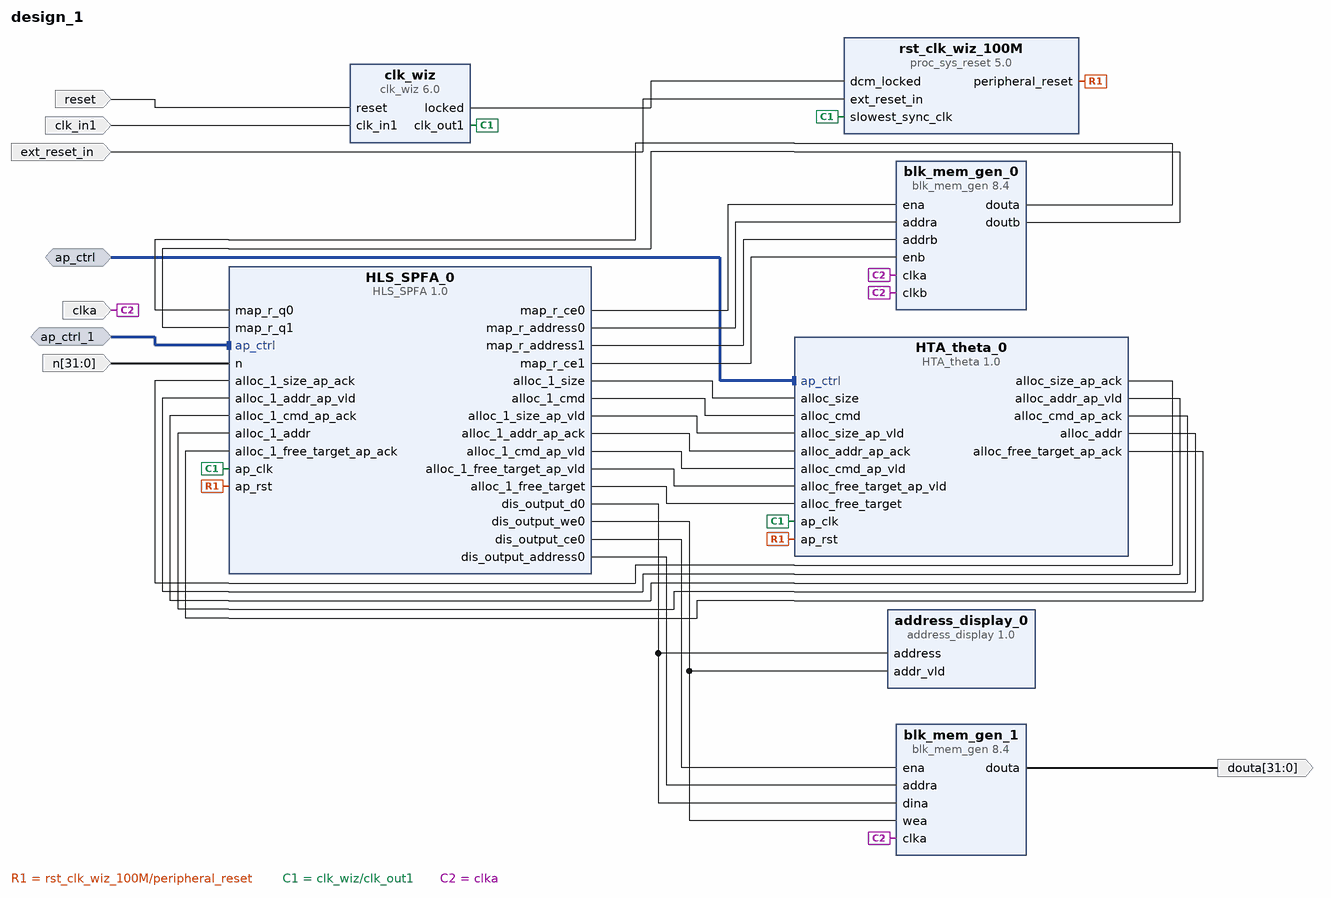
[diagram p0: block diagram of the top level]
# Vivado block design design_1, xc7z020clg484-1, Vivado 2018.2
create_bd_design design_1

create_bd_intf_port -mode Slave -vlnv xilinx.com:interface:acc_handshake_rtl:1.0 ap_ctrl
create_bd_intf_port -mode Slave -vlnv xilinx.com:interface:acc_handshake_rtl:1.0 ap_ctrl_1
create_bd_port -dir I -from 31 -to 0 -type data n
set_property -dict [list \
  CONFIG.LAYERED_METADATA {xilinx.com:interface:datatypes:1.0 {DATA {datatype {name {attribs {resolve_type immediate dependency {} format string minimum {} maximum {}} value {}} bitwidth {attribs {resolve_type immediate dependency {} format long minimum {} maximum {}} value 32} bitoffset {attribs {resolve_type immediate dependency {} format long minimum {} maximum {}} value 0} integer {signed {attribs {resolve_type immediate dependency {} format bool minimum {} maximum {}} value true}}}}}} \
] [get_bd_ports n]
create_bd_port -dir I -type rst reset
set_property -dict {CONFIG.POLARITY ACTIVE_HIGH} [get_bd_ports reset]
create_bd_port -dir I -type clk clk_in1
create_bd_port -dir I -type rst ext_reset_in
create_bd_port -dir O -from 31 -to 0 douta
create_bd_port -dir I -type clk clka

create_bd_cell -type ip -vlnv xilinx.com:hls:HTA_theta:1.0 HTA_theta_0
create_bd_cell -type ip -vlnv xilinx.com:ip:blk_mem_gen:8.4 blk_mem_gen_0
set_property -dict [list \
  CONFIG.Memory_Type Dual_Port_ROM \
  CONFIG.Enable_32bit_Address false \
  CONFIG.Write_Depth_A 20000 \
  CONFIG.Enable_B Use_ENB_Pin \
  CONFIG.Register_PortA_Output_of_Memory_Primitives true \
  CONFIG.Register_PortB_Output_of_Memory_Primitives true \
  CONFIG.Load_Init_File true \
  CONFIG.Coe_File mapINPUT.coe \
  CONFIG.Use_RSTA_Pin false \
  CONFIG.Use_RSTB_Pin false \
  CONFIG.Port_A_Write_Rate 0 \
  CONFIG.Port_B_Clock 100 \
  CONFIG.Port_B_Write_Rate 0 \
  CONFIG.Port_B_Enable_Rate 100 \
  CONFIG.use_bram_block Stand_Alone \
] [get_bd_cells blk_mem_gen_0]
create_bd_cell -type ip -vlnv xilinx.com:ip:blk_mem_gen:8.4 blk_mem_gen_1
set_property -dict [list \
  CONFIG.Memory_Type Single_Port_RAM \
  CONFIG.Enable_32bit_Address false \
  CONFIG.Use_Byte_Write_Enable false \
  CONFIG.Write_Depth_A 200 \
  CONFIG.Register_PortA_Output_of_Memory_Primitives true \
  CONFIG.Use_RSTA_Pin false \
  CONFIG.Port_B_Clock 0 \
  CONFIG.Port_B_Write_Rate 0 \
  CONFIG.Port_B_Enable_Rate 0 \
  CONFIG.use_bram_block Stand_Alone \
] [get_bd_cells blk_mem_gen_1]
create_bd_cell -type ip -vlnv xilinx.com:ip:clk_wiz:6.0 clk_wiz
create_bd_cell -type ip -vlnv xilinx.com:ip:proc_sys_reset:5.0 rst_clk_wiz_100M
create_bd_cell -type ip -vlnv xilinx.com:hls:HLS_SPFA:1.0 HLS_SPFA_0
create_bd_cell -type ip -vlnv user.org:user:address_display:1.0 address_display_0

# ---- connections ----

connect_bd_intf_net [get_bd_intf_ports ap_ctrl] [get_bd_intf_pins HTA_theta_0/ap_ctrl]
connect_bd_intf_net -intf_net ap_ctrl_1_1 [get_bd_intf_ports ap_ctrl_1] [get_bd_intf_pins HLS_SPFA_0/ap_ctrl]
connect_bd_net [get_bd_pins HTA_theta_0/alloc_size_ap_ack] [get_bd_pins HLS_SPFA_0/alloc_1_size_ap_ack]
connect_bd_net [get_bd_pins HTA_theta_0/alloc_addr_ap_vld] [get_bd_pins HLS_SPFA_0/alloc_1_addr_ap_vld]
connect_bd_net [get_bd_pins HTA_theta_0/alloc_cmd_ap_ack] [get_bd_pins HLS_SPFA_0/alloc_1_cmd_ap_ack]
# net HTA_theta_0_alloc_idle_ap_vld has one end: 
connect_bd_net [get_bd_pins HTA_theta_0/alloc_addr] [get_bd_pins HLS_SPFA_0/alloc_1_addr]
connect_bd_net [get_bd_pins HLS_SPFA_0/alloc_1_size] [get_bd_pins HTA_theta_0/alloc_size]
connect_bd_net [get_bd_pins HLS_SPFA_0/alloc_1_cmd] [get_bd_pins HTA_theta_0/alloc_cmd]
connect_bd_net [get_bd_pins HLS_SPFA_0/alloc_1_size_ap_vld] [get_bd_pins HTA_theta_0/alloc_size_ap_vld]
connect_bd_net [get_bd_pins HLS_SPFA_0/alloc_1_addr_ap_ack] [get_bd_pins HTA_theta_0/alloc_addr_ap_ack]
connect_bd_net [get_bd_pins HLS_SPFA_0/alloc_1_cmd_ap_vld] [get_bd_pins HTA_theta_0/alloc_cmd_ap_vld]
# net HLS_SPFA_0_alloc_1_idle_ap_ack has one end: 
# net HTA_theta_0_alloc_idle has one end: 
connect_bd_net [get_bd_pins clk_wiz/locked] [get_bd_pins rst_clk_wiz_100M/dcm_locked]
connect_bd_net [get_bd_pins rst_clk_wiz_100M/peripheral_reset] [get_bd_pins HTA_theta_0/ap_rst] [get_bd_pins HLS_SPFA_0/ap_rst]
connect_bd_net [get_bd_ports n] [get_bd_pins HLS_SPFA_0/n]
connect_bd_net [get_bd_ports reset] [get_bd_pins clk_wiz/reset]
connect_bd_net -net clk_in1_1 [get_bd_ports clk_in1] [get_bd_pins clk_wiz/clk_in1]
connect_bd_net [get_bd_ports ext_reset_in] [get_bd_pins rst_clk_wiz_100M/ext_reset_in]
connect_bd_net [get_bd_pins HLS_SPFA_0/map_r_ce0] [get_bd_pins blk_mem_gen_0/ena]
connect_bd_net [get_bd_pins HLS_SPFA_0/map_r_address0] [get_bd_pins blk_mem_gen_0/addra]
connect_bd_net [get_bd_pins blk_mem_gen_0/douta] [get_bd_pins HLS_SPFA_0/map_r_q0]
connect_bd_net [get_bd_pins HLS_SPFA_0/dis_output_d0] [get_bd_pins blk_mem_gen_1/dina] [get_bd_pins address_display_0/address]
connect_bd_net [get_bd_pins HLS_SPFA_0/dis_output_ce0] [get_bd_pins blk_mem_gen_1/ena]
connect_bd_net [get_bd_pins HLS_SPFA_0/dis_output_we0] [get_bd_pins blk_mem_gen_1/wea] [get_bd_pins address_display_0/addr_vld]
connect_bd_net [get_bd_pins HLS_SPFA_0/dis_output_address0] [get_bd_pins blk_mem_gen_1/addra]
connect_bd_net [get_bd_pins blk_mem_gen_1/douta] [get_bd_ports douta]
connect_bd_net [get_bd_pins clk_wiz/clk_out1] \
  [get_bd_pins HTA_theta_0/ap_clk] [get_bd_pins rst_clk_wiz_100M/slowest_sync_clk] [get_bd_pins HLS_SPFA_0/ap_clk]
connect_bd_net [get_bd_ports clka] [get_bd_pins blk_mem_gen_0/clka] [get_bd_pins blk_mem_gen_0/clkb] [get_bd_pins blk_mem_gen_1/clka]
connect_bd_net [get_bd_pins HLS_SPFA_0/map_r_address1] [get_bd_pins blk_mem_gen_0/addrb]
connect_bd_net [get_bd_pins blk_mem_gen_0/doutb] [get_bd_pins HLS_SPFA_0/map_r_q1]
connect_bd_net [get_bd_pins HLS_SPFA_0/map_r_ce1] [get_bd_pins blk_mem_gen_0/enb]
connect_bd_net [get_bd_pins HLS_SPFA_0/alloc_1_free_target_ap_vld] [get_bd_pins HTA_theta_0/alloc_free_target_ap_vld]
connect_bd_net [get_bd_pins HTA_theta_0/alloc_free_target_ap_ack] [get_bd_pins HLS_SPFA_0/alloc_1_free_target_ap_ack]
connect_bd_net [get_bd_pins HLS_SPFA_0/alloc_1_free_target] [get_bd_pins HTA_theta_0/alloc_free_target]

validate_bd_design
save_bd_design
